# EAGLE design Cosmic Pi Analogue V2.5 OHL no logo (EAGLE 8.3.1)
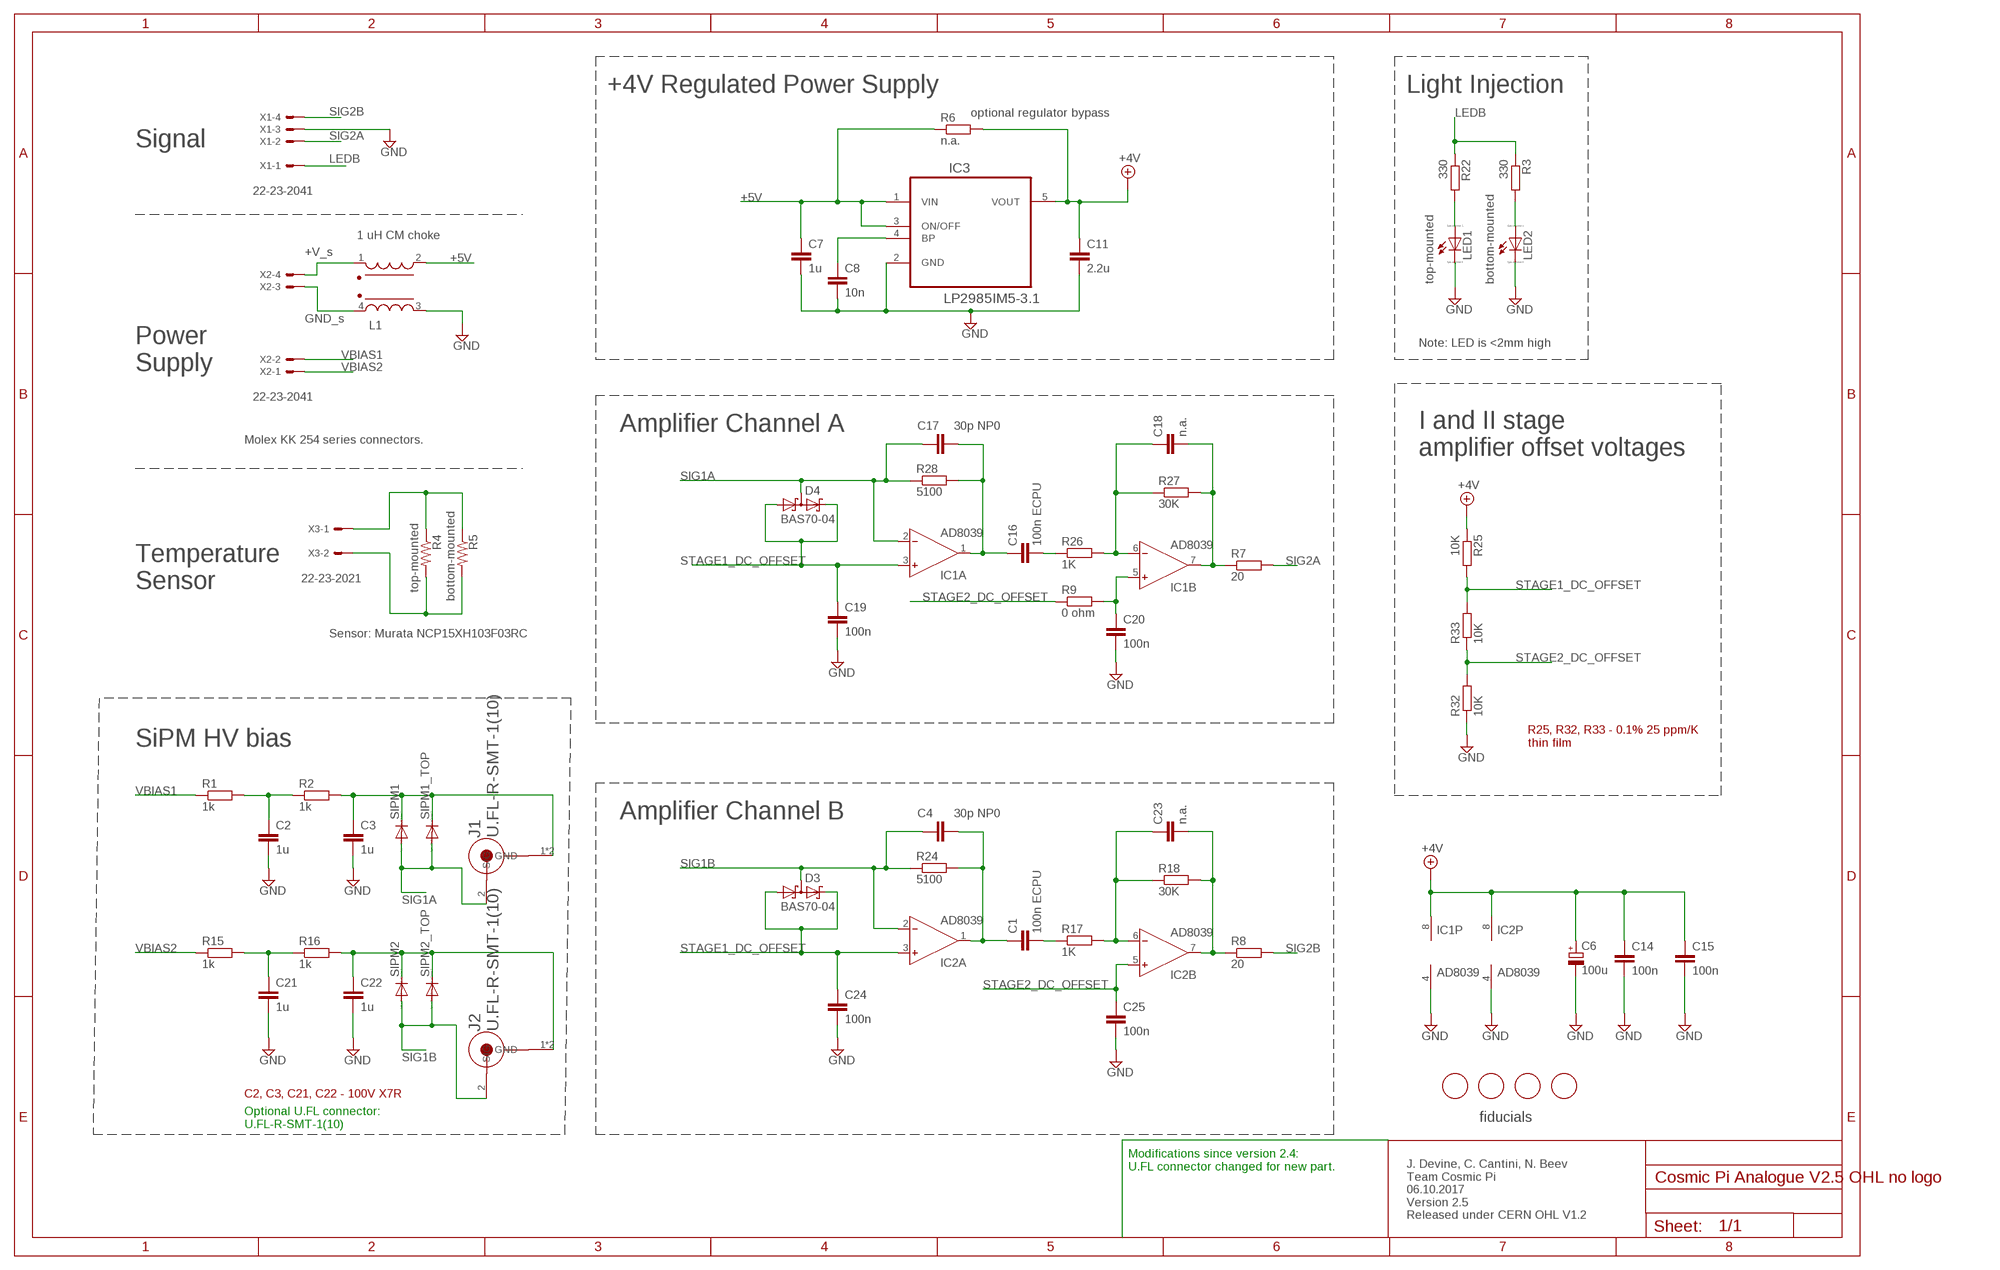
[diagram p0: schematic, sheet 1]

## Parts
C1  100n ECPU  C-EUC0805  [C0805]
C2  1u  C-EUC1206  [C1206]
C3  1u  C-EUC1206  [C1206]
C4  30p NP0  C-EUC0603  [C0603]
C6  100u  CPOL-EUC/6032-28R  [C/6032-28R]
C7  1u  C-EUC0603  [C0603]
C8  10n  C-EUC0603  [C0603]
C11  2.2u  C-EUC0603  [C0603]
C14  100n  C-EUC0603  [C0603]
C15  100n  C-EUC0603  [C0603]
C16  100n ECPU  C-EUC0805  [C0805]
C17  30p NP0  C-EUC0603  [C0603]
C18  n.a.  C-EUC0603  [C0603]
C19  100n  C-EUC0603  [C0603]
C20  100n  C-EUC0603  [C0603]
C21  1u  C-EUC1206  [C1206]
C22  1u  C-EUC1206  [C1206]
C23  n.a.  C-EUC0603  [C0603]
C24  100n  C-EUC0603  [C0603]
C25  100n  C-EUC0603  [C0603]
D3  BAS70-04  [SOT23]
D4  BAS70-04  [SOT23]
IC1  AD8039  AD8033R  [SO8]
IC2  AD8039  AD8033R  [SO8]
IC3  LP2985IM5-3.1  [SOT95P284X120-5N]
J1  U.FL-R-SMT-1(10)  [HRS_U.FL-R-SMT-1(10)]
J2  U.FL-R-SMT-1(10)  [HRS_U.FL-R-SMT-1(10)]
L1  1 uH CM choke  WE-CNSW_1812_744235601  [WE-CNSW_1812]
LED1  top-mounted  LED_ESML0603  [LED_SML0603]
LED2  bottom-mounted  LED_ESML0603  [LED_SML0603]
R1  1k  R-EU_R1206  [R1206]
R2  1k  R-EU_R1206  [R1206]
R3  330  R-EU_R0603  [R0603]
R4  top-mounted  R-US_R0402  [R0402]
R5  bottom-mounted  R-US_R0402  [R0402]
R6  n.a.  R-EU_R0603  [R0603]
R7  20  R-EU_R0603  [R0603]
R8  20  R-EU_R0603  [R0603]
R9  0 ohm  R-EU_R1206  [R1206]
R15  1k  R-EU_R1206  [R1206]
R16  1k  R-EU_R1206  [R1206]
R17  1K  R-EU_R0603  [R0603]
R18  30K  R-EU_R0603  [R0603]
R22  330  R-EU_R0603  [R0603]
R24  5100  R-EU_R0603  [R0603]
R25  10K  R-EU_R0805  [R0805]
R26  1K  R-EU_R0603  [R0603]
R27  30K  R-EU_R0603  [R0603]
R28  5100  R-EU_R0603  [R0603]
R32  10K  R-EU_R0805  [R0805]
R33  10K  R-EU_R0805  [R0805]
SIPM1  DIODE-ADVANSID  [ASD-NUV3S-P]
SIPM1_TOP  DIODE-ADVANSID  [ASD-NUV3S-P]
SIPM2  DIODE-ADVANSID  [ASD-NUV3S-P]
SIPM2_TOP  DIODE-ADVANSID  [ASD-NUV3S-P]
U$2  FIDUCIAL  [FIDUCIAL_1MM]
U$3  FIDUCIAL  [FIDUCIAL_1MM]
U$4  FIDUCIAL  [FIDUCIAL_1MM]
U$5  FIDUCIAL  [FIDUCIAL_1MM]
X1  22-23-2041  [22-23-2041]
X2  22-23-2041  [22-23-2041]
X3  22-23-2021  [22-23-2021]

## Nets
+4V: C6.+ C11.1 C14.1 C15.1 IC1.8(P:V+) IC2.8(P:V+) IC3.5(VOUT) R6.2 R25.1
+5V [5V]: C7.1 IC3.1(VIN) IC3.3(ON/OFF) L1.2 R6.1
GND [sipmearth]: C2.2 C3.2 C6.- C7.2 C8.2 C11.2 C14.2 C15.2 C19.2 C20.2 C21.2 C22.2 C24.2 C25.2 IC1.4(P:V-) IC2.4(P:V-) IC3.2(GND) L1.3 LED1.C LED2.C R32.1 X1.3
LEDB: R3.1 R22.1 X1.1
N$1: L1.1 X2.4
N$2: L1.4 X2.3
N$3: LED2.A R3.2
N$4: C8.1 IC3.4(BP)
N$5: C21.1 R15.2 R16.1
N$6: C18.2 IC1.7(B:OUT) R7.1 R27.2
N$7: C22.1 J2.1(GND) J2.3(GND) R16.2 SIPM2.P$1(C) SIPM2_TOP.P$1(C)
N$8: R4.1 R5.1 X3.1
N$9: C23.2 IC2.7(B:OUT) R8.1 R18.2
N$11: C2.1 R1.2 R2.1
N$12: R4.2 R5.2 X3.2
N$13: C20.1 IC1.5(B:IN+) R9.2
N$18: C3.1 J1.1(GND) J1.3(GND) R2.2 SIPM1.P$1(C) SIPM1_TOP.P$1(C)
N$20: LED1.A R22.2
N$23: C1.1 C4.2 IC2.1(A:OUT) R24.2
N$24: C1.2 R17.1
N$25: C23.1 IC2.6(B:IN-) R17.2 R18.1
N$31: C16.1 C17.2 IC1.1(A:OUT) R28.2
N$32: C16.2 R26.1
N$33: C18.1 IC1.6(B:IN-) R26.2 R27.1
SIG1A [Signal]: C17.1 D4.3(C1A2) IC1.2(A:IN-) J1.2(SIG) R28.1 SIPM1.P$2(A) SIPM1_TOP.P$2(A)
SIG1B: C4.1 D3.3(C1A2) IC2.2(A:IN-) J2.2(SIG) R24.1 SIPM2.P$2(A) SIPM2_TOP.P$2(A)
SIG2A [Signal]: R7.2 X1.2
SIG2B: R8.2 X1.4
STAGE1_DC_OFFSET: C19.1 C24.1 D3.1(A1) D3.2(C2) D4.1(A1) D4.2(C2) IC1.3(A:IN+) IC2.3(A:IN+) R25.2 R33.2
STAGE2_DC_OFFSET: C25.1 IC2.5(B:IN+) R9.1 R32.2 R33.1
VBIAS1: R1.1 X2.2
VBIAS2: R15.1 X2.1

## Notes on the sheet
- +4V Regulated Power Supply | Light Injection
- optional regulator bypass
- Signal
- +V_s
- GND_s
- Note: LED is <2mm high
- Power
  Supply
- Amplifier Channel A
- Molex KK 254 series connectors.
- I and II stage 
  amplifier offset voltages
- Temperature 
  Sensor
- Sensor: Murata NCP15XH103F03RC
- SiPM HV bias
- R25, R32, R33 - 0.1% 25 ppm/K
  thin film
- Amplifier Channel B
- C2, C3, C21, C22 - 100V X7R
- fiducials
- Optional U.FL connector:
  U.FL-R-SMT-1(10)
- Modifications since version 2.4:
  U.FL connector changed for new part.
- J. Devine, C. Cantini, N. Beev
  Team Cosmic Pi
  06.10.2017
  Version 2.5
  Released under CERN OHL V1.2

## Library data of the parts
C1-C4 C16-C18 C21-C23 = rcl:C-EU: CAPACITOR, European symbol
C6 = rcl:CPOL-EU: POLARIZED CAPACITOR, European symbol
C7 C8 C11 C14 C15 C19 C20 C24 C25 = resistor:C-EU: CAPACITOR, European symbol
D3 D4 = diode:BAS70-04: Silicon Schottky Diodes General-purpose diode for high-speed switching
IC1 IC2 = analog-devices:AD8033: 2.7 V, 800 ?A, 80 MHz Rail-to-Rail I/O Amplifiers Source: http://www.analog.com/static/imported-files/data_sheets/AD8031_8032.pdf; MF: ALTERA CORPORATION; MPN: AD8033ARZ; OC_FARNELL: 8621519; OC_NEWARK: 59K6245
IC3 = LP2985IM5-3.1:LP2985IM5-3.1: Low-Dropout Regulator
J1 J2 = U.FL-R-SMT-1_10_:U.FL-R-SMT-1(10): U.FL, Ultra Miniature Coaxial Connector Receptacle, Male Pin 50 Ohm Surface Mount Solder; AVAILABILITY: Good; DESCRIPTION: U.FL Series 6 Ghz 50 Ohm Ultra-small SMT Coaxial Cable Receptacle; MF: Hirose; MP: U.FL-R-SMT-1(10); PACKAGE: None; PRICE: 0.73 USD
L1 = EMCComponents (rev17d):WE-CNSW_1812: WE-CNSW SMD Common Mode Line Filter Characteristics High common mode noise suppression at high frequencies Small influence on high speed signals through winding symmetry Operating temperature: –40 ºC to +125 ºC (Size 0805/1206/1812); –40 ºC to +105 ºC (Size 0603) Applications USB 2.0 IEEE 1394 (Firewire) LVDS High Speed Data Lines LAN <http://katalog.we-online.de/media/images/eisos/IndCNSW_pf2.jpg> Details see: http://katalog.we-online.de/en/pbs/WE-CNSW Updated by Dan Xu 2014-06-30 2014 (C) Wurth Elektronik; WE-NUMBER: 744235601/1uH
LED1 LED2 = eagle-ltspice:LED_E: LED Source: http://www.osram.convergy.de Source: www.luxeon.com Source: www.kingbright.com; SPICEMODEL: NONE; SPICEPREFIX: D; SPICETYPE: diode
R1 R2 R6-R9 R15-R18 R24-R28 R32 R33 = rcl:R-EU_: RESISTOR, European symbol
R3 R22 = resistor:R-EU_: RESISTOR, European symbol
R4 R5 = rcl:R-US_: RESISTOR, American symbol
SIPM1 SIPM1_TOP SIPM2 SIPM2_TOP = diode:DIODE-: DIODE
U$2-U$5 = adafruit:FIDUCIAL: For use by pick and place machines to calibrate the vision/machine, 1mm By microbuilder.eu
X1 X2 = con-molex:22-23-2041: .100" (2.54mm) Center Header - 4 Pin; MF: MOLEX; MPN: 22-23-2041; OC_FARNELL: 1462920; OC_NEWARK: 38C0355
X3 = con-molex:22-23-2021: .100" (2.54mm) Center Header - 2 Pin; MF: MOLEX; MPN: 22-23-2021; OC_FARNELL: 1462926; OC_NEWARK: 25C3832

## Net classes
0 default: width 0.406 mm, clearance 0.127 mm
1 Ground: width 0.406 mm, clearance 0.127 mm
2 5V: width 0.406 mm, clearance 0.127 mm
3 4V: width 0.406 mm, clearance 0.127 mm
4 Signal: width 0.406 mm, clearance 0.127 mm
5 sipmearth: width 0.406 mm, clearance 0.127 mm
6 planes: clearance 0.61 mm

## Board
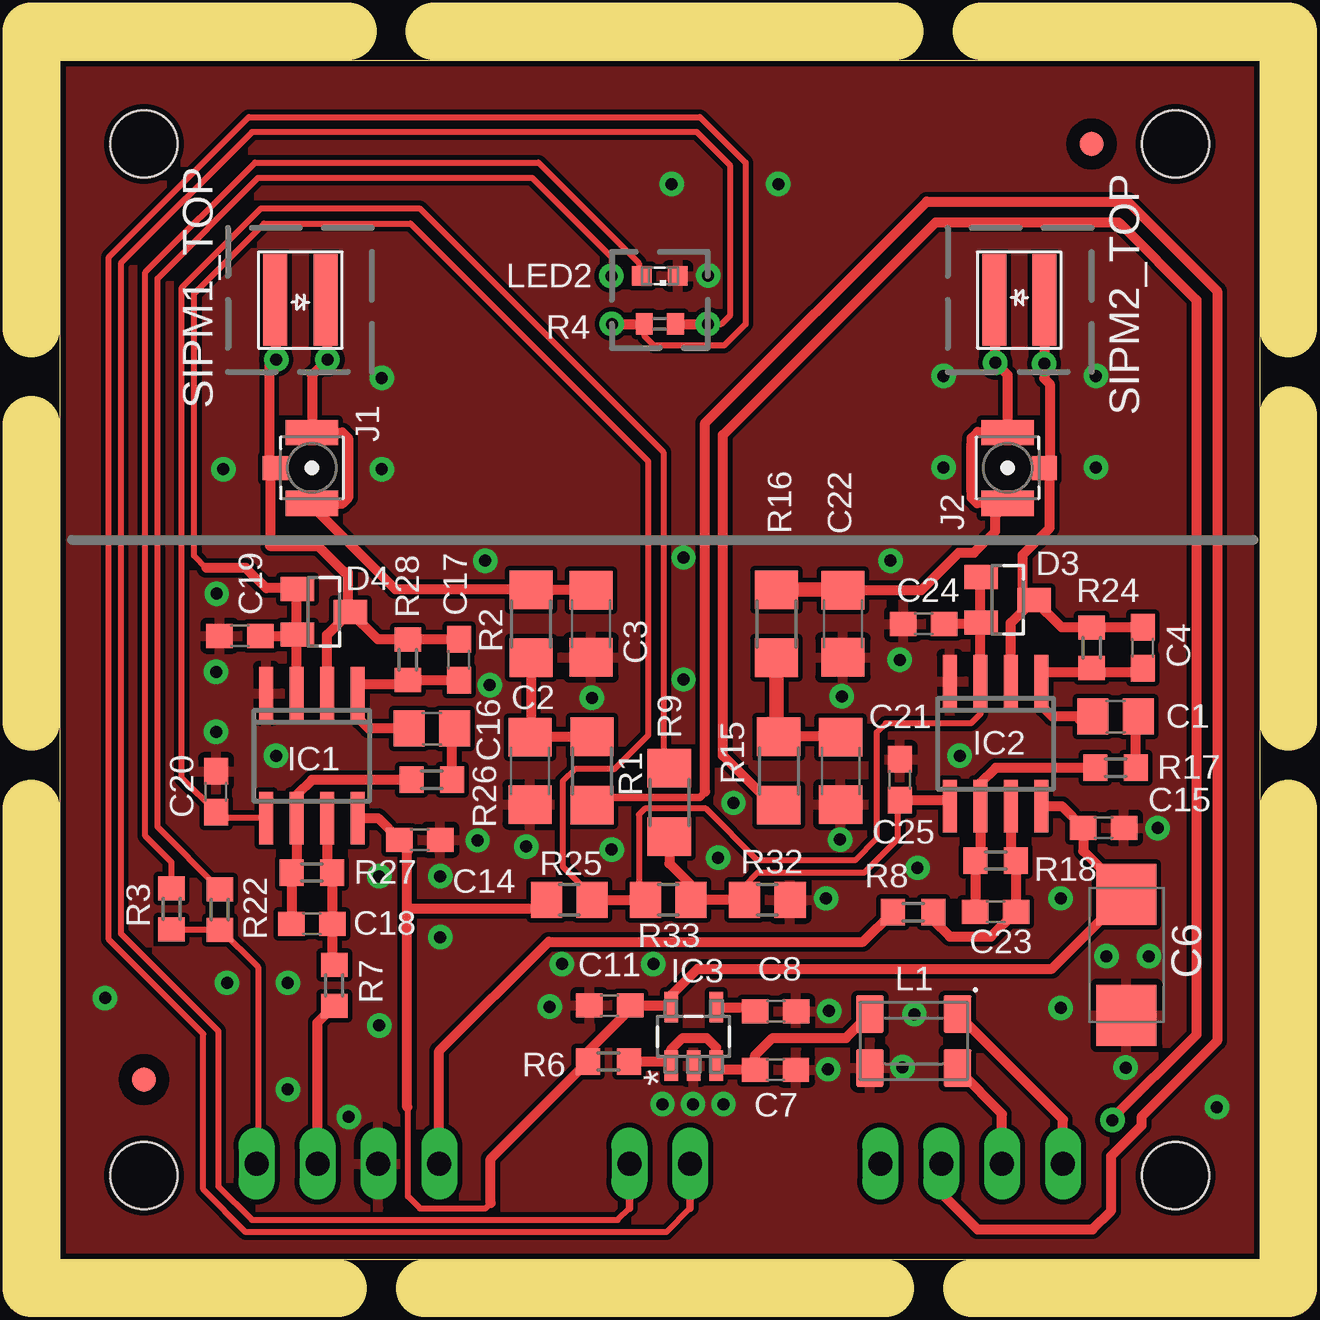
[diagram p1: board, top side]
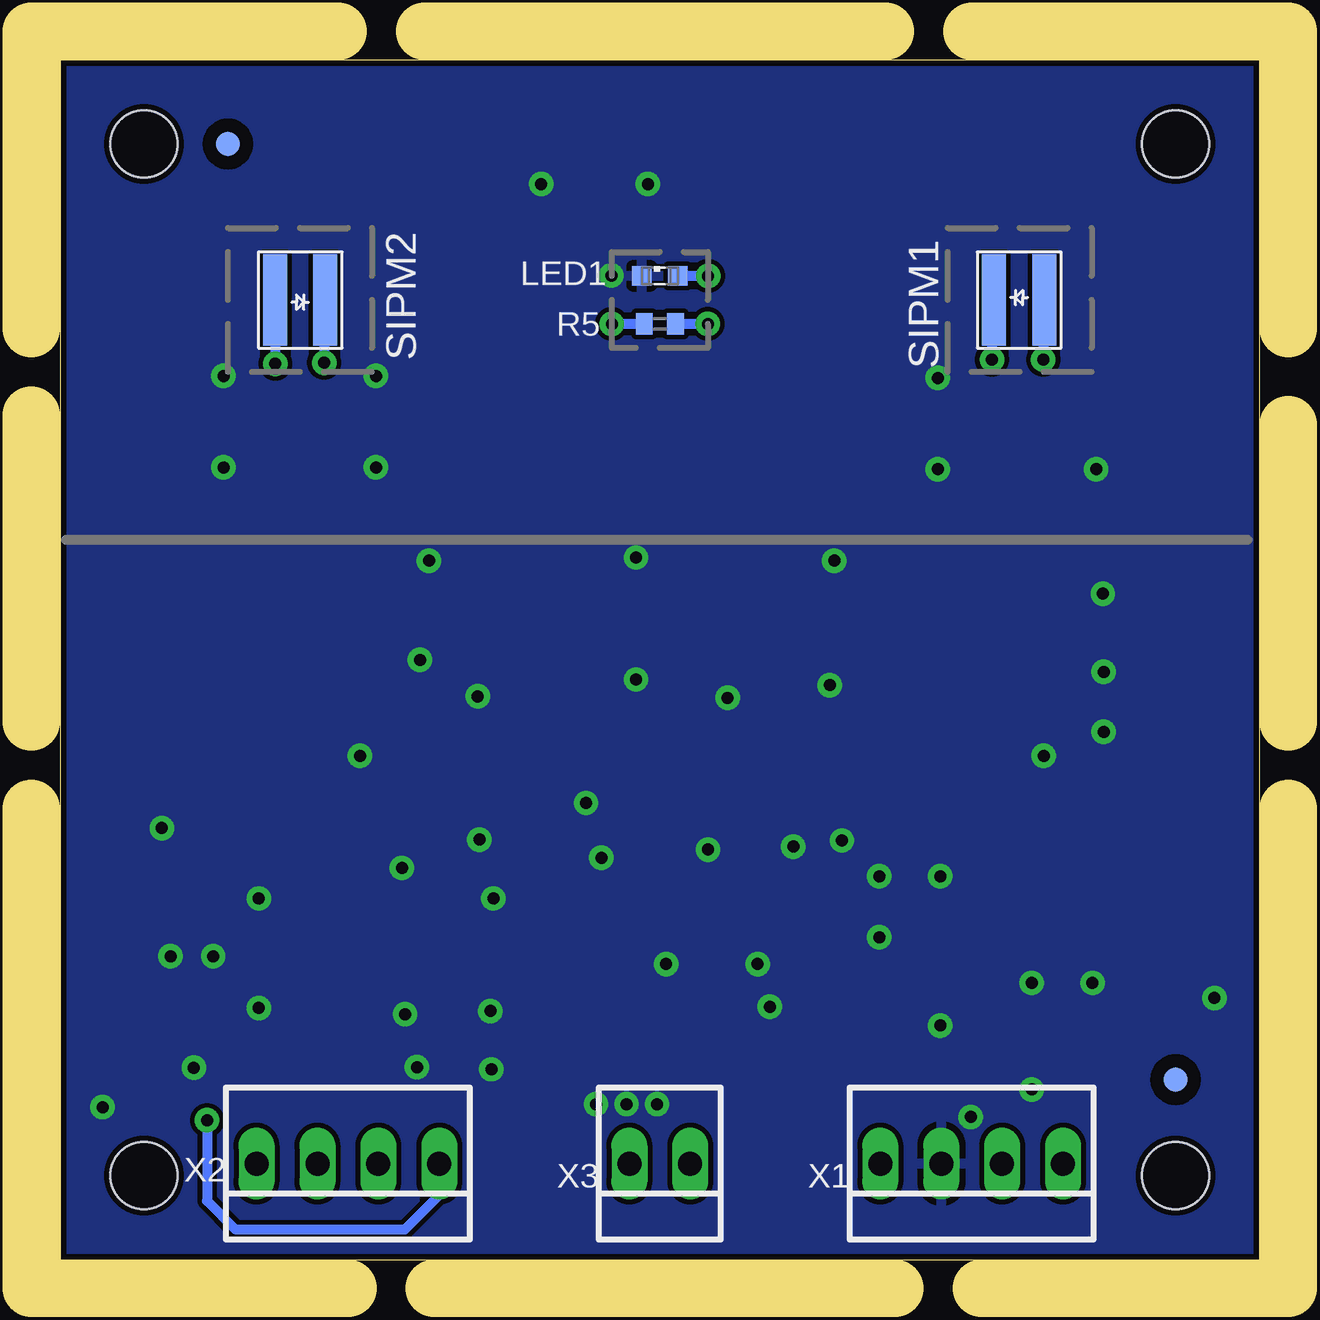
[diagram p2: board, bottom side, seen from below]

Size 50 x 50 mm. Coordinates in mm from the lower left corner, seen from the top.
Outline: 50,0 0,0 0,50 50,50 50,0
Copper layers (1*16): Top 0.035mm / dielectric 1.5mm / Bottom 0.035mm
Design rules "pcbtrain github": minimum track width 0.2mm, minimum drill 0.4mm, track to track 0.2mm, track to pad 0.2mm, pad to pad 0.2mm, via to via 0.2mm, smd to smd 0mil, copper to edge 10mil, drill to drill 0.2mm, minimum pad ring 10mil, minimum via ring 10mil, stop-mask expansion 0.125mm, vias tented up to drill 0mil, thermal gap 10mil
Holes 2.8 mm at 46.5,3.5 3.5,46.5 46.5,46.5 3.5,3.5
Milling: 12 lines

### Footprints (pad centres in the part's own frame; a part is rotated, then mirrored left to right if it is on the bottom)
C0805 = smd 1.3 x 1.5: 1 -0.95,0; 2 0.95,0
C1206 = smd 1.6 x 1.8: 1 -1.4,0; 2 1.4,0
C0603 = smd 1.1 x 1: 1 -0.85,0; 2 0.85,0
C/6032-28R = smd 2.55 x 2.5: + 2.525,0; - -2.525,0
SOT23 = smd 1 x 1.4: 1 -0.95,-1.1; 2 0.95,-1.1; 3 0,1.1
SO8 = smd 0.6 x 2.2: 1 -1.905,-2.6; 2 -0.635,-2.6; 3 0.635,-2.6; 4 1.905,-2.6; 5 1.905,2.6; 6 0.635,2.6; 7 -0.635,2.6; 8 -1.905,2.6
SOT95P284X120-5N = smd 1.27 x 0.559: 1 -1.219,0.94; 2 -1.219,0; 3 -1.219,-0.94; 4 1.219,-0.94; 5 1.219,0.94
HRS_U.FL-R-SMT-1(10) = smd 1.05 x 2.2: 1 -1.475,0; 3 1.475,0 | smd 1 x 1.05: 2 0,-1.525
WE-CNSW_1812 = smd 1.15 x 1.55: 1 -1.825,-1.125; 2 1.825,-1.125; 3 1.825,1.125; 4 -1.825,1.125
LED_SML0603 = smd 0.8 x 0.8: A 0.75,0; C -0.75,0
R1206 = smd 1.6 x 1.803: 1 -1.422,0; 2 1.422,0
R0603 = smd 1 x 1.1: 1 -0.85,0; 2 0.85,0
R0402 = smd 0.7 x 0.9: 1 -0.65,0; 2 0.65,0
R0805 = smd 1.3 x 1.5: 1 -0.95,0; 2 0.95,0
ASD-NUV3S-P = smd 1 x 3.83: P$1 0.7,-2; P$2 2.8,-2
FIDUCIAL_1MM = smd 1 x 1: 1 0,0
22-23-2041 = drill 1 long: 1 -3.81,0; 2 -1.27,0; 3 1.27,0; 4 3.81,0
22-23-2021 = drill 1 long: 1 -1.27,0; 2 1.27,0

### Placement (x,y rotation side)
C1  44,22.63 0 top
C2  19.59,20.36 270 top
C3  22.14,26.5 270 top
C4  45.13,25.5 270 top
C6  44.45,12.7 90 top
C7  29.83,7.91 0 top
C8  29.84,10.34 0 top
C11  22.91,10.6 180 top
C14  15,17.5 0 top
C15  43.5,18 0 top
C16  15.5,22.13 0 top
C17  16.63,25 270 top
C18  10.5,14 0 top
C19  7.5,26 180 top
C20  6.5,19.5 90 top
C21  32.54,20.36 270 top
C22  32.63,26.5 270 top
C23  39,14.5 0 top
C24  36,26.5 180 top
C25  35,20 90 top
D3  39.5,27.5 270 top
D4  11,27 270 top
IC1  10.5,21 180 top
IC2  39,21.5 180 top
IC3  26.41,9.3 90 top
J1  10.5,33 270 top
J2  39.5,33 90 top
L1  35.59,9.11 180 top
LED1  25,41 0 bottom
LED2  25,41 180 top
R1  22.18,20.36 90 top
R2  19.64,26.5 90 top
R3  4.65,14.61 90 top
R4  25,39 180 top
R5  25,39 0 bottom
R6  22.86,8.26 180 top
R7  11.43,11.43 270 top
R8  35.56,14.48 180 top
R9  25.4,19.05 90 top
R15  29.96,20.36 90 top
R16  29.86,26.5 90 top
R17  44,20.5 180 top
R18  39,16.63 0 top
R22  6.66,14.58 90 top
R24  43,25.5 270 top
R25  21.23,15 0 top
R26  15.5,20 180 top
R27  10.5,16.13 0 top
R28  14.5,25 270 top
R32  29.48,15 180 top
R33  25.36,15 180 top
SIPM1  11.77,42 0 bottom
SIPM1_TOP  11.77,38 180 top
SIPM2  38.24,38 180 bottom
SIPM2_TOP  38.24,42 0 top
U$2  43,46.5 180 bottom
U$3  3.5,7.5 180 top
U$4  3.5,7.5 180 bottom
U$5  43,46.5 180 top
X1  12,4 180 bottom
X2  38,4 180 bottom
X3  25,4 180 bottom

### Tracks (layer width: path | path; a pad name or v marks a point on that pad's centre or on a via)
+4V
  Top 0.254: 17.95,2.35 17.73,2.13 15,2.13 14.5,2.63 14.5,6.25 14.48,6.35
  Top 0.406: IC2.8 41.75,18.9 C15.1 42.65,17.02 C6.+ 41.34,12.12 26.58,12.12 25.47,11.01 IC3.5 25.39,10.6 C11.1 | IC1.8 13.25,18.4 C14.1 14.5,17.02 14.48,17 14.48,14.61 | 24.03,10.37 C11.1 | R25.1 20.28,14.75 20.14,14.61 14.48,14.61 | 14.48,6.35 14.48,14.61 | C11.1 23.5,10.33 23.5,10.16 22.01,8.68 R6.2 17.95,4.2 17.95,2.35
+5V
  Top 0.406: C7.1 27.52,7.91 IC3.3 27.35,8.84 26.95,9.24 25.95,9.24 25.47,8.76 IC3.1 25.3,8.26 R6.1 | C7.1 28.98,8.52 29.7,9.24 32.76,9.24 L1.2 | 28.79,7.72 C7.1
GND  (via drill 0.5 pad 0.81, 0.5 pad 1.02)
  other vias: 6.5,24.5 35,25 20.42,10.54 27.44,16.75 19.44,17.21 6.5,22 9,21 37.5,21 15.85,15.98 32.02,7.93 45.76,17.98 34.62,29.13 32.06,10.36 35.12,8.02 22.17,23.41 26.39,6.47 29.94,44.83 25.5,44.83 31.93,15.05 41.71,10.48 45.4,12.64 43.62,12.64 6.53,27.75 35.62,10.23 15.85,13.44 6.96,11.53 44.42,8 20.92,12.32 32.59,23.48 17.91,23.95 17.73,29.13 25.98,29.25 6.81,32.94 13.41,32.94 36.83,33.02 43.18,33.02 41.71,15.05 9.5,11.53 25.11,6.47 27.66,6.47 32.52,17.51 35.74,16.32 24.73,12.32 13.31,15.98 12.04,5.94 9.5,7.09 1.88,10.9 13.41,36.75 36.83,36.83 43.18,36.83 22.99,17.09 48.23,6.35 27.02,41.02 13.31,9.75 25.98,24.18 28.07,19.03 17.4,17.47
  pour Top: -2.54,52.07 -2.54,-2.54 52.07,-2.54 52.07,52.07
  pour Bottom: -2.54,52.07 -2.54,-2.54 52.07,-2.54 52.07,52.07
LEDB
  Top 0.254: R3.1 6.64,13.76 R22.1 6.67,13.78 8.26,12.19 8.26,4.07 X1.1
N$1
  Top 0.406: X2.4 41.81,5.84 L1.1
N$2
  Top 0.406: L1.4 37.48,7.86 39.27,6.07 X2.3
N$3
  Top 0.254: R3.2 4.65,16.56 3.56,17.65 3.56,41.15 8.13,45.72 19.94,45.72 24.13,41.53 24.13,41.12 LED2.A
N$4
  Top 0.406: IC3.4 28.98,10.52 C8.1
N$5
  Top 0.406: 29.52,22.42 R15.2 29.98,21.8 32.5,21.8 C21.1
  Top 0.61: R16.1 29.86,22.52 R15.2
N$6
  Top 0.406: IC1.7 11.13,16.21 R27.2 C18.2 11.35,12.36 R7.1
N$7  (via drill 0.5 pad 1.02)
  Top 0.406: SIPM2_TOP.P$1 38.98,39.57 v38.98,37.38 39.5,36.87 J2.3 39.48,34.5 38.25,34.5 38,34.25 38,34.01 38,34 38,32 38,31.99 38,31.75 38.23,31.52 J2.1 38.98,31.01 38.98,30.35 38.1,29.46 37.47,29.46 35.9,27.9 C22.1 | 32.08,28 32.38,28
  Top 0.61: R16.2 32.46,27.92 | C22.1 32.61,27.92 32.46,27.92 | 32.46,27.92 32.38,28
  Bottom 0.406: SIPM2_TOP.P$1 38.98,40 v38.98,37.38
N$8  (via drill 0.5 pad 1.02)
  Top 0.254: 23.73,2.14 23.24,1.65 8,1.65 6.6,3.05 6.6,9.53 2.54,13.59 2.54,41.53 8,46.99 26.54,46.99 27.94,45.59 27.94,39.37 27.57,39 v27,39 26.92,39
  Top 0.305: 23.73,2.14 X3.1
  Top 0.406: R5.1 26.92,39
  Bottom 0.406: v27,39 R5.1 26.67,39
N$9
  Top 0.406: IC2.7 39.63,16.71 R18.2 C23.2 38.81,13.46 37.08,13.46 36.41,14.14 R8.1
N$11
  Top 0.406: R2.1 19.64,21.8 | 19.64,21.8 C2.1 | 19.64,21.8 21.52,21.8 R1.2
N$12  (via drill 0.5 pad 1.02)
  Top 0.254: 26.27,2.14 25.27,1.14 7.75,1.14 5.97,2.92 5.97,9.4 2.03,13.34 2.03,41.78 7.87,47.62 26.67,47.62 28.57,45.72 28.57,38.99 27.69,38.1 24.77,38.1 24.35,38.52 R5.2
  Top 0.305: 26.27,2.14 X3.2
  Top 0.406: 24.35,38.73 R5.2 v23,39
  Bottom 0.406: v23,39 R5.2
N$13
  Top 0.254: IC1.5 6.37,18.4 | R9.2 25.15,20.73 25.15,33.66 14.99,43.81 8.38,43.81 5.08,40.51 5.08,20.07 C20.1
  Top 0.406: 6.37,18.4 6.5,18.4 C20.1
N$18  (via drill 0.5 pad 1.02)
  Top 0.406: C3.1 20.52,27.9 R2.2 19.62,27.94 13.97,27.94 10.5,31.41 J1.3 10.53,31.5 11.75,31.5 12,31.75 12,31.99 12,32 12,34 12,34.01 12,34.25 11.78,34.48 J1.1 10.5,36.86 v11.15,37.51 11.15,38.38 10.79,38.73 10.79,39.73 SIPM1_TOP.P$1 10.77,39.7
  Bottom 0.406: SIPM1_TOP.P$1 11.15,40 v11.15,37.51
N$20  (via drill 0.5 pad 1.02)
  Top 0.254: R22.2 4.06,18.03 4.06,40.89 8.26,45.09 19.68,45.09 22.99,41.78 v22.99,41
  Bottom 0.406: v22.99,41 LED1.A
N$23
  Top 0.406: 42.51,22.5 C1.1 41.37,22.63 41,23 41,24 IC2.1 40.91,24.41 41,24.5 43,24.5 | 43,24.5 44.95,24.5 C4.2 | R24.2 43,24.5
N$24
  Top 0.406: R17.1 44.85,22.4 C1.2
N$25
  Top 0.406: C23.1 R18.1 38.37,16.32 IC2.6 38.37,19.86 39,20.5 R17.2
N$31
  Top 0.406: C17.2 R28.2 14.45,24 12.5,24 12.4,23.91 IC1.1 12.5,23.5 12.5,22.5 12.87,22.13 C16.1
N$32
  Top 0.406: R26.1 16.35,21.9 C16.2
N$33
  Top 0.406: 9.87,15.81 R27.1 | R27.1 C18.1 | R27.1 9.87,16.21 IC1.6 9.87,19.36 10.5,20 R26.2
SIG1A  (via drill 0.5 pad 1.02)
  Top 0.406: IC1.2 11.13,26.04 D4.3 | C17.1 R28.1 13.25,25.85 D4.3 | D4.3 12,27.1 12,28.64 11.86,28.64 10.75,29.75 8.75,29.75 8.75,32.77 J1.2 8.72,33.25 8.72,37.47 v9.02,37.51 9.02,39.7 SIPM1_TOP.P$2
  Bottom 0.406: SIPM1_TOP.P$2 9.02,40 v9.02,37.51
SIG1B  (via drill 0.5 pad 1.02)
  Top 0.406: IC2.2 39.63,26.54 D3.3 | D3.3 41.75,26.35 R24.1 C4.1 | 41,27.4 D3.3 | SIPM2_TOP.P$2 41.04,37.61 v41.02,37.34 41.02,36.73 41.25,36.5 41.25,33.23 41.14,33.12 | D3.3 40.13,27.85 40.13,29.38 41.25,30.5 41.25,32.76 41.14,33.12 | 41,32.98 J2.2 41.14,33.12
  Bottom 0.406: SIPM2_TOP.P$2 41.04,37.35 v41.02,37.34
SIG2A
  Top 0.406: X1.2 10.73,9.88 R7.2
SIG2B
  Top 0.406: X1.4 15.81,8.69 20.36,13.25 33.48,13.25 R8.2
STAGE1_DC_OFFSET
  Top 0.254: IC1.3 9.87,27.98 | 6.1,28.83 5.59,29.34 5.59,40.26 8.51,43.18 14.61,43.18 24.51,33.27 24.51,21.84 23.11,20.45 21.46,20.45 20.95,19.94 20.95,16.38 22.1,15.24 22.1,15.08 R25.2 | IC2.3 38.37,22.74 37.97,22.35 34.42,22.35 34.04,21.97 34.04,17.53 33.15,16.64 29.08,16.64 26.92,18.8 24.38,18.8 24.13,18.54 24.13,15
  Top 0.406: 38.37,26.5 38.37,28.41 D3.1 38.05,28.45 | 38.37,26.5 38.4,26.54 D3.2 38.37,26.52 IC2.3 | 38.37,26.5 C24.1 | R25.2 24.13,15 R33.2 | IC1.3 9.87,26 | 9.87,26 9.87,27.91 | 9.87,27.91 9.87,27.98 8.6,27.98 7.75,28.83 6.1,28.83 | 9.87,27.91 D4.1 | C19.1 9.85,26 D4.2 9.9,26.04 9.87,26
STAGE2_DC_OFFSET
  Top 0.254: R32.2 28.53,15.58 29.08,16.13 33.53,16.13 34.92,17.53 34.92,19.07 C25.1
  Top 0.406: C25.1 36.84,19.15 IC2.5 | R32.2 R33.1 26.55,15.24 26.67,15.24 25.4,16.51 R9.1
VBIAS1
  Top 0.305: 21.77,19.27 26.67,19.27 26.89,19.49
  Top 0.406: R1.1 22.04,19 21.77,19.27 | 26.89,19.49 26.89,34.87 36.13,44.1 44.5,44.1 48.24,40.37 48.24,9.11 45.09,5.97 45.09,5.84 45.09,5.59 43.81,4.32 43.81,2.03 43.04,1.25 38.25,1.25 36.73,2.77 X2.2
VBIAS2  (via drill 0.5 pad 1.02)
  Top 0.406: 29.65,19.37 R15.1 29.69,18.67 29.46,19.18 27.64,21.01 27.64,34.37 36.5,43.23 44.13,43.23 47.37,39.99 47.37,9.37 43.87,5.88 v43.87,5.81
  Bottom 0.406: X2.1 34.19,2.68 35.63,1.25 42.67,1.25 43.87,2.45 v43.87,5.81

### Text on the board
tDocu: A | K | K | A | LED | SIG A | GND | SIG B | HV A B | GND_s | +V_s | T sensor
bDocu: A | K | K | A
silktop: Released under CERN OHL V1.2 | CosmicPi / Analog Frontend / V 2.5 NB'17